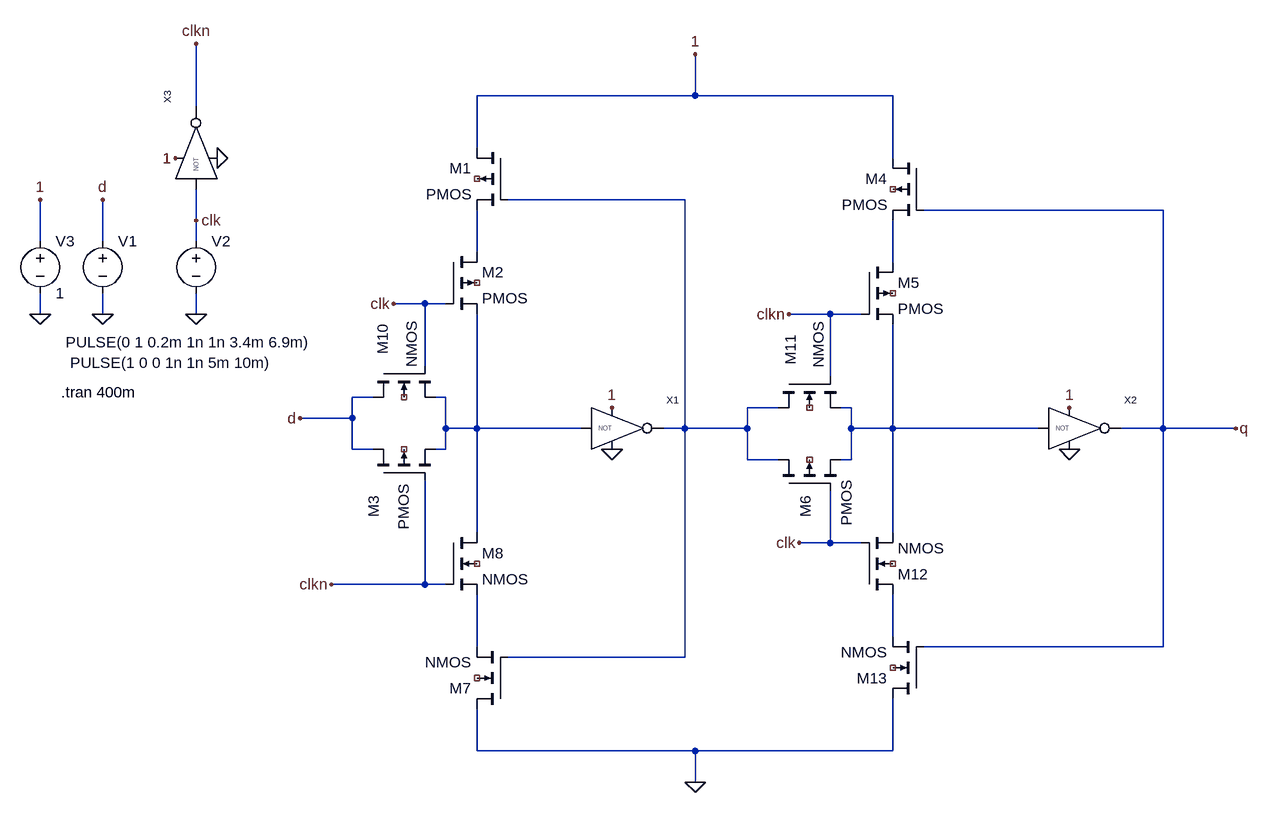
[diagram p0: schematic d_flipflop_tgate_deneme.asc]
* d_flipflop_tgate_deneme.asc
M3 d clkn N004 NC_01 PMOS
M6 N001 clk N005 NC_02 PMOS
XX1 N004 1 0 N001 NOT4  ; pins A VH VL OUT
XX2 N005 1 0 q NOT4  ; pins A VH VL OUT
M8 N004 clkn N007 NC_03 NMOS
M10 d clk N004 NC_04 NMOS
M11 N001 clkn N005 NC_05 NMOS
M12 N006 clk N005 NC_06 NMOS
M13 0 q N006 NC_07 NMOS
V1 d 0 PULSE(0 1 0.2m 1n 1n 3.4m 6.9m)
V2 clk 0 PULSE(1 0 0 1n 1n 5m 10m)
V3 1 0 1
XX3 clk 1 0 clkn NOT4  ; pins A VH VL OUT
M1 1 N001 N002 NC_08 PMOS
M2 N002 clk N004 NC_09 PMOS
M4 1 q N003 NC_10 PMOS
M5 N003 clkn N005 NC_11 PMOS
M7 0 N001 N007 NC_12 NMOS
.model NMOS NMOS
.model PMOS PMOS
.lib standard.mos
.tran 400m
.backanno
.end

* Results of the author's LTspice run, read from the files saved beside the schematic
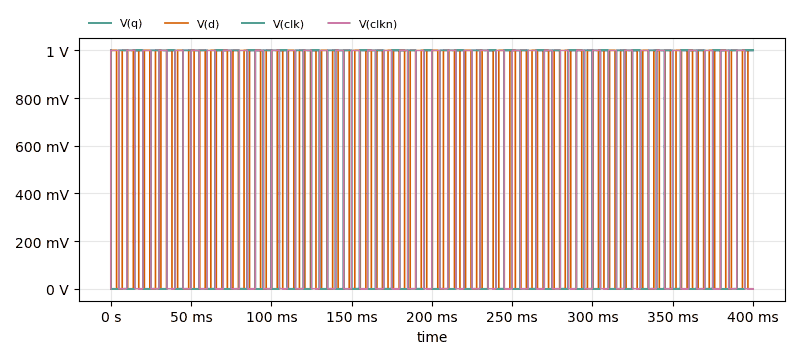
[diagram p1: Transient Analysis of d_flipflop_tgate_deneme.asc, plotted from the saved traces]
* Transient Analysis, 1 run:
*   V(q): min 100.5 nV, max 1 V, average 500 mV, rms 707.1 mV, last 1 V
*   V(d): min 0 V, max 1 V, average 493 mV, rms 702.1 mV, last 0 V
*   V(clk): min 0 V, max 1 V, average 500 mV, rms 707.1 mV, last 1 V
*   V(clkn): min 0 V, max 1 V, average 500 mV, rms 707.1 mV, last 100.5 nV